# EAGLE design untitled (EAGLE 5.11)
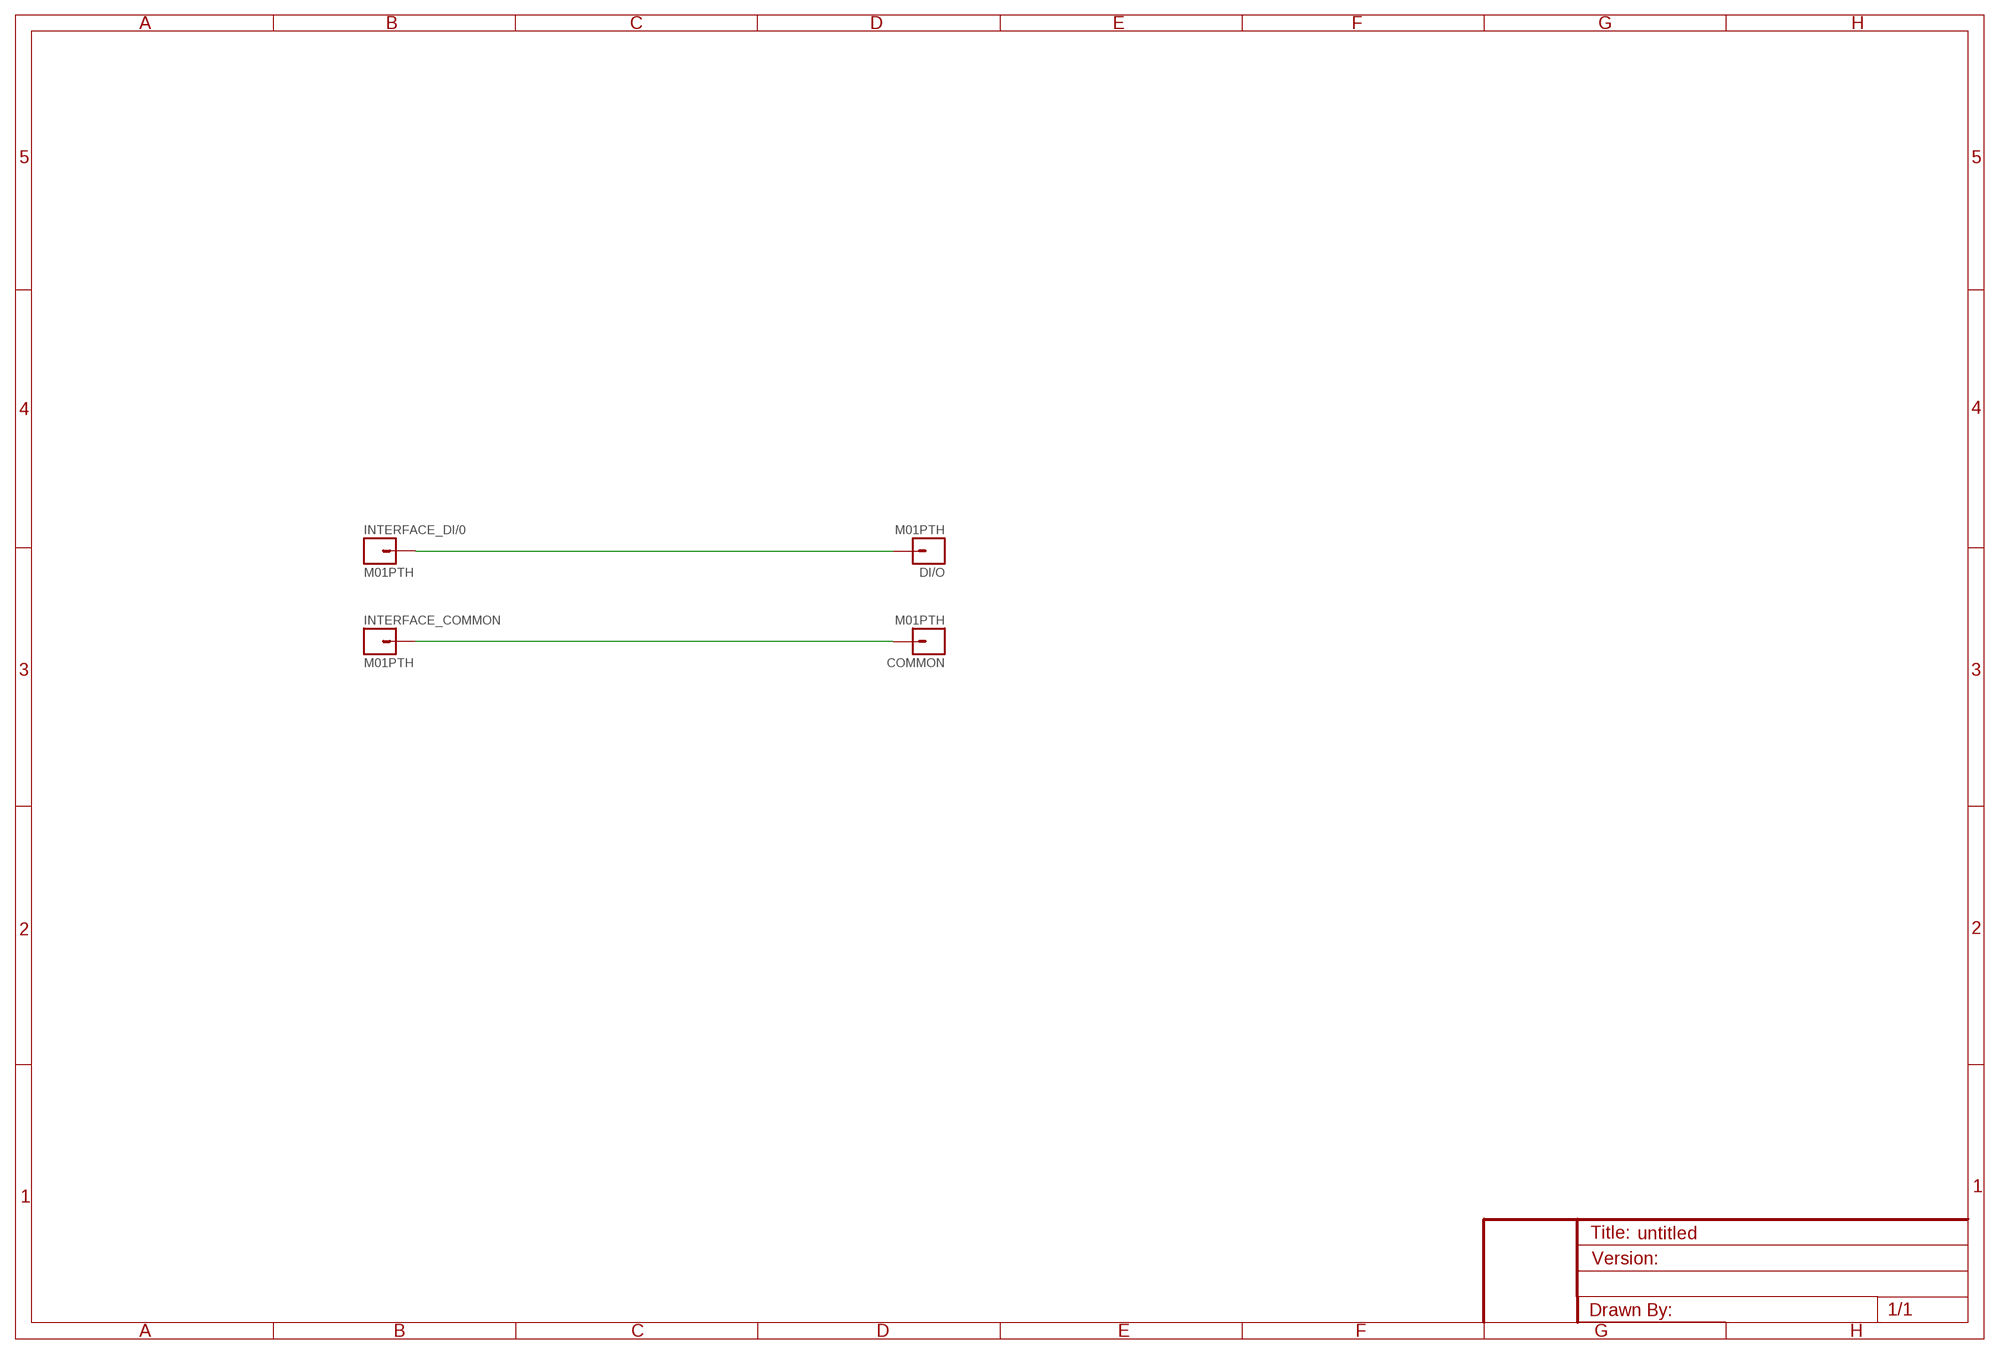
[diagram p0: schematic, sheet 1]

## Parts
COMMON  M01PTH  [1X01]
DI/O  M01PTH  [1X01]
INTERFACE_COMMON  M01PTH  [1X01]
INTERFACE_DI/0  M01PTH  [1X01]

## Nets
COMMON: COMMON.1 INTERFACE_COMMON.1
DI/O: DI/O.1 INTERFACE_DI/0.1

## Library data of the parts
COMMON DI/O INTERFACE_COMMON INTERFACE_DI/0 = SparkFun:M01: Header 1 Standard 1-pin 0.1" header. Use with straight break away headers (SKU : PRT-00116), right angle break away headers (PRT-00553), swiss pins (PRT-00743), machine pins (PRT-00117), and female headers (PRT-00115).

## Board
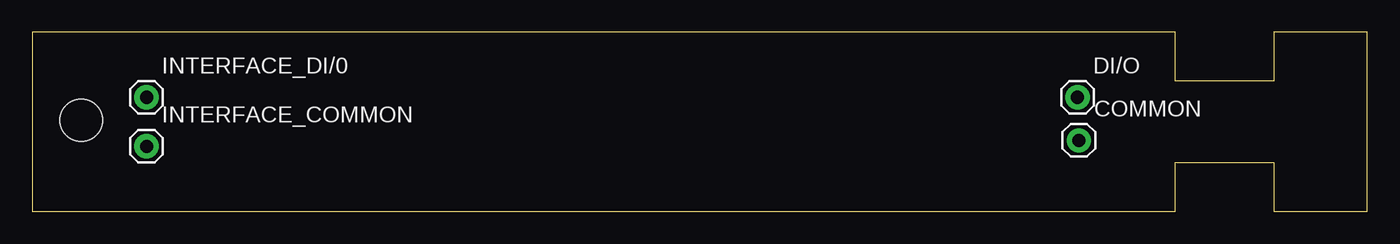
[diagram p1: board, top side]
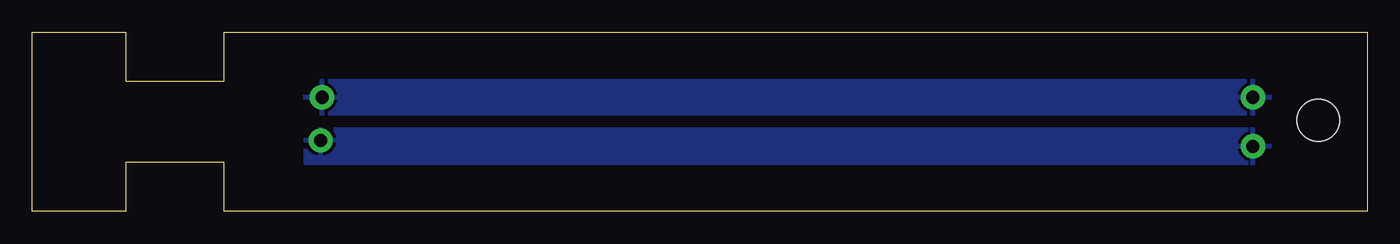
[diagram p2: board, bottom side, seen from below]

Size 103.81 x 13.97 mm. Coordinates in mm from the lower left corner, seen from the top.
Outline: 0,0 87.63,0 88.9,0 88.9,3.81 96.52,3.81 96.52,0 103.81,0 103.81,13.96 96.52,13.97 96.52,10.15 88.9,10.15 88.9,13.97 0,13.96 0,0
Copper layers (1*16): Top 0.035mm / dielectric 1.5mm / Bottom 0.035mm
Design rules "default": minimum track width 10mil, minimum drill 24mil, track to track 8mil, track to pad 8mil, pad to pad 8mil, via to via 8mil, smd to smd 8mil, copper to edge 40mil, drill to drill 8mil, minimum pad ring 10mil, minimum via ring 8mil, stop-mask expansion 4mil, vias tented up to drill 0mil, thermal gap 10mil

### Footprints (pad centres in the part's own frame; a part is rotated, then mirrored left to right if it is on the bottom)
1X01 = drill 1.016 pad 1.88 round: 1 0,0
STAND-OFF = hole 3.302: 0,0

### Placement (x,y rotation side)
COMMON  81.38,5.54 0 top
DI/O  81.28,8.89 0 top
INTERFACE_COMMON  8.89,5.08 0 top
INTERFACE_DI/0  8.89,8.89 0 top
U$1  [STAND-OFF]  3.81,7.11 90 top

### Tracks (layer width: path | path; a pad name or v marks a point on that pad's centre or on a via)
COMMON
  pour Bottom: 7.62,6.35 82.55,6.35 82.55,3.81 7.62,3.81
DI/O
  pour Bottom: 7.62,7.62 82.55,7.62 82.55,10.16 7.62,10.16